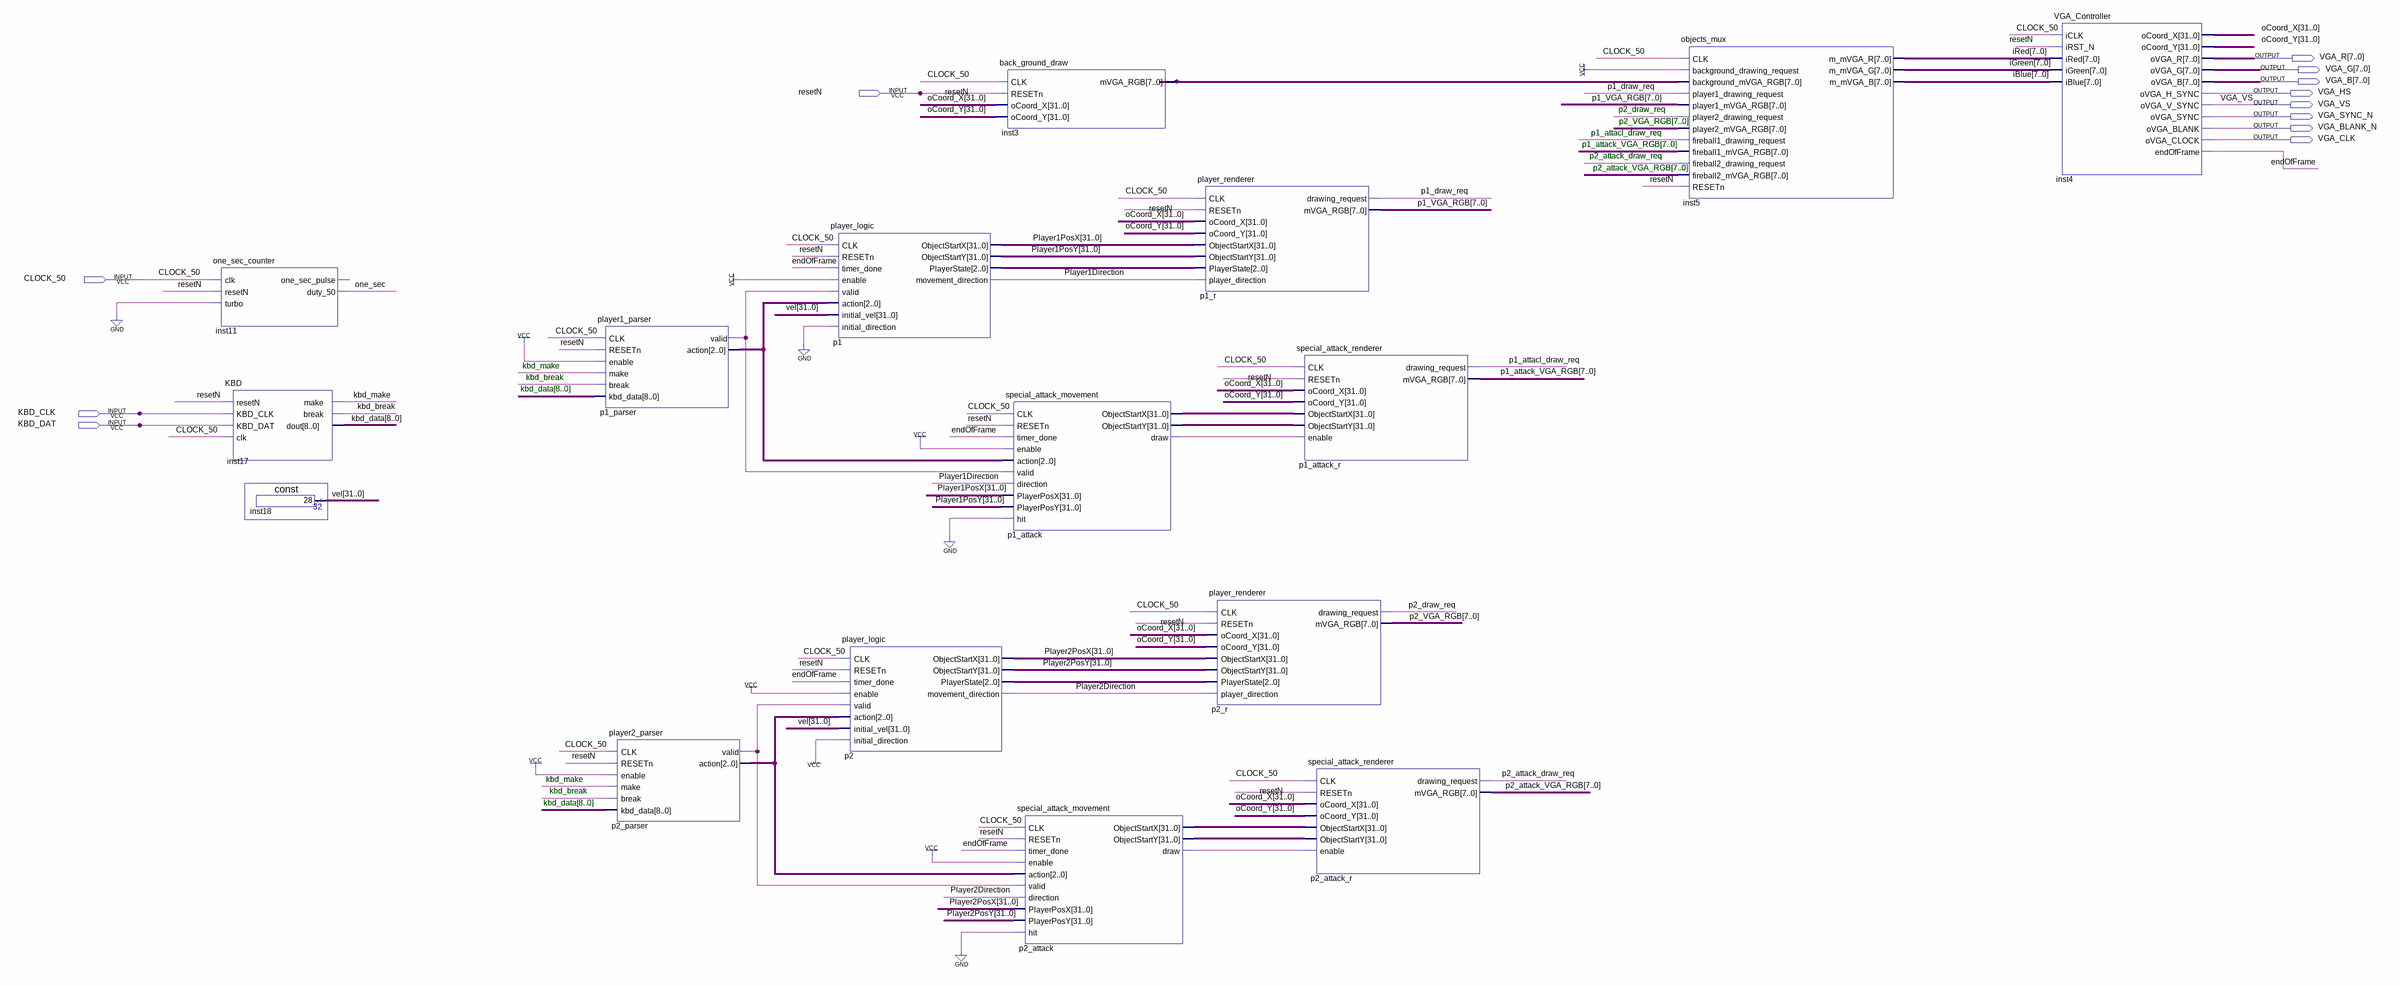
[diagram p0: schematic sheet]
// Quartus schematic Test_simple.bdf as structural Verilog: 16 symbols, 12 pins
module Test_simple (
  input  resetN,
  input  CLOCK_50,
  input  KBD_CLK,
  input  KBD_DAT,
  output [7:0] VGA_R,
  output [7:0] VGA_G,
  output [7:0] VGA_B,
  output VGA_HS,
  output VGA_VS,
  output VGA_SYNC_N,
  output VGA_BLANK_N,
  output VGA_CLK
);

  wire endOfFrame, kbd_break, kbd_make, one_sec, p1_attack_draw, p1_attacl_draw_req, p1_draw_req,
       p1_parser_valid, p2_attack_draw, p2_attack_draw_req, p2_draw_req, p2_parser_valid, Player1Direction,
       Player2Direction;
  wire [2:0] p1_parser_action, p1_playerstate, p2_parser_action, p2_playerstate;
  wire [7:0] iBlue, iGreen, inst3_mvga_rgb, iRed, p1_attack_VGA_RGB, p1_VGA_RGB, p2_attack_VGA_RGB,
       p2_VGA_RGB;
  wire [8:0] kbd_data;
  wire [31:0] oCoord_X, oCoord_Y, p1_attack_objectstartx, p1_attack_objectstarty, p2_attack_objectstartx,
       p2_attack_objectstarty, Player1PosX, Player1PosY, Player2PosX, Player2PosY, vel;

  one_sec_counter inst11 (.clk(CLOCK_50), .resetN(resetN), .turbo(1'b0), .duty_50(one_sec));  // open: one_sec_pulse
  KBD inst17 (
    .resetN(resetN), .KBD_CLK(KBD_CLK), .KBD_DAT(KBD_DAT), .clk(CLOCK_50), .make(kbd_make),
    .\break (kbd_break), .dout(kbd_data));
  \const  inst18 (.result(vel));
  player1_parser p1_parser (
    .CLK(CLOCK_50), .RESETn(resetN), .enable(1'b1), .make(kbd_make), .\break (kbd_break),
    .kbd_data(kbd_data), .valid(p1_parser_valid), .action(p1_parser_action));
  player2_parser p2_parser (
    .CLK(CLOCK_50), .RESETn(resetN), .enable(1'b1), .make(kbd_make), .\break (kbd_break),
    .kbd_data(kbd_data), .valid(p2_parser_valid), .action(p2_parser_action));
  player_logic p1 (
    .CLK(CLOCK_50), .RESETn(resetN), .timer_done(endOfFrame), .enable(1'b1), .valid(p1_parser_valid),
    .action(p1_parser_action), .initial_vel(vel), .initial_direction(1'b0), .ObjectStartX(Player1PosX),
    .ObjectStartY(Player1PosY), .PlayerState(p1_playerstate), .movement_direction(Player1Direction));
  player_logic p2 (
    .CLK(CLOCK_50), .RESETn(resetN), .timer_done(endOfFrame), .enable(1'b1), .valid(p2_parser_valid),
    .action(p2_parser_action), .initial_vel(vel), .initial_direction(1'b1), .ObjectStartX(Player2PosX),
    .ObjectStartY(Player2PosY), .PlayerState(p2_playerstate), .movement_direction(Player2Direction));
  back_ground_draw inst3 (
    .CLK(CLOCK_50), .RESETn(resetN), .oCoord_X(oCoord_X), .oCoord_Y(oCoord_Y), .mVGA_RGB(inst3_mvga_rgb));
  special_attack_movement p1_attack (
    .CLK(CLOCK_50), .RESETn(resetN), .timer_done(endOfFrame), .enable(1'b1), .action(p1_parser_action),
    .valid(p1_parser_valid), .direction(Player1Direction), .PlayerPosX(Player1PosX),
    .PlayerPosY(Player1PosY), .hit(1'b0), .ObjectStartX(p1_attack_objectstartx),
    .ObjectStartY(p1_attack_objectstarty), .draw(p1_attack_draw));
  special_attack_movement p2_attack (
    .CLK(CLOCK_50), .RESETn(resetN), .timer_done(endOfFrame), .enable(1'b1), .action(p2_parser_action),
    .valid(p2_parser_valid), .direction(Player2Direction), .PlayerPosX(Player2PosX),
    .PlayerPosY(Player2PosY), .hit(1'b0), .ObjectStartX(p2_attack_objectstartx),
    .ObjectStartY(p2_attack_objectstarty), .draw(p2_attack_draw));
  player_renderer p1_r (
    .CLK(CLOCK_50), .RESETn(resetN), .oCoord_X(oCoord_X), .oCoord_Y(oCoord_Y), .ObjectStartX(Player1PosX),
    .ObjectStartY(Player1PosY), .PlayerState(p1_playerstate), .player_direction(Player1Direction),
    .drawing_request(p1_draw_req), .mVGA_RGB(p1_VGA_RGB));
  player_renderer p2_r (
    .CLK(CLOCK_50), .RESETn(resetN), .oCoord_X(oCoord_X), .oCoord_Y(oCoord_Y), .ObjectStartX(Player2PosX),
    .ObjectStartY(Player2PosY), .PlayerState(p2_playerstate), .player_direction(Player2Direction),
    .drawing_request(p2_draw_req), .mVGA_RGB(p2_VGA_RGB));
  special_attack_renderer p1_attack_r (
    .CLK(CLOCK_50), .RESETn(resetN), .oCoord_X(oCoord_X), .oCoord_Y(oCoord_Y),
    .ObjectStartX(p1_attack_objectstartx), .ObjectStartY(p1_attack_objectstarty), .enable(p1_attack_draw),
    .drawing_request(p1_attacl_draw_req), .mVGA_RGB(p1_attack_VGA_RGB));
  special_attack_renderer p2_attack_r (
    .CLK(CLOCK_50), .RESETn(resetN), .oCoord_X(oCoord_X), .oCoord_Y(oCoord_Y),
    .ObjectStartX(p2_attack_objectstartx), .ObjectStartY(p2_attack_objectstarty), .enable(p2_attack_draw),
    .drawing_request(p2_attack_draw_req), .mVGA_RGB(p2_attack_VGA_RGB));
  objects_mux inst5 (
    .CLK(CLOCK_50), .background_drawing_request(1'b1), .background_mVGA_RGB(inst3_mvga_rgb),
    .player1_drawing_request(p1_draw_req), .player1_mVGA_RGB(p1_VGA_RGB),
    .player2_drawing_request(p2_draw_req), .player2_mVGA_RGB(p2_VGA_RGB),
    .fireball1_drawing_request(p1_attacl_draw_req), .fireball1_mVGA_RGB(p1_attack_VGA_RGB),
    .fireball2_drawing_request(p2_attack_draw_req), .fireball2_mVGA_RGB(p2_attack_VGA_RGB), .RESETn(resetN),
    .m_mVGA_R(iRed), .m_mVGA_G(iGreen), .m_mVGA_B(iBlue));
  VGA_Controller inst4 (
    .iCLK(CLOCK_50), .iRST_N(resetN), .iRed(iRed), .iGreen(iGreen), .iBlue(iBlue), .oCoord_X(oCoord_X),
    .oCoord_Y(oCoord_Y), .oVGA_R(VGA_R), .oVGA_G(VGA_G), .oVGA_B(VGA_B), .oVGA_H_SYNC(VGA_HS),
    .oVGA_V_SYNC(VGA_VS), .oVGA_SYNC(VGA_SYNC_N), .oVGA_BLANK(VGA_BLANK_N), .oVGA_CLOCK(VGA_CLK),
    .endOfFrame(endOfFrame));

  // Notes on the sheet:
  //   p2_draw_req
  //   p2_VGA_RGB[7..0]
  //   p1_attacl_draw_req
  //   p1_attack_VGA_RGB[7..0]
  //   p2_attack_draw_req
  //   p2_attack_VGA_RGB[7..0]
  //   kbd_make
  //   kbd_break
  //   kbd_data[8..0]
  //   kbd_make
  //   kbd_break
  //   kbd_data[8..0]
endmodule
